# Altium schematic sheet node.SchDoc
size A4
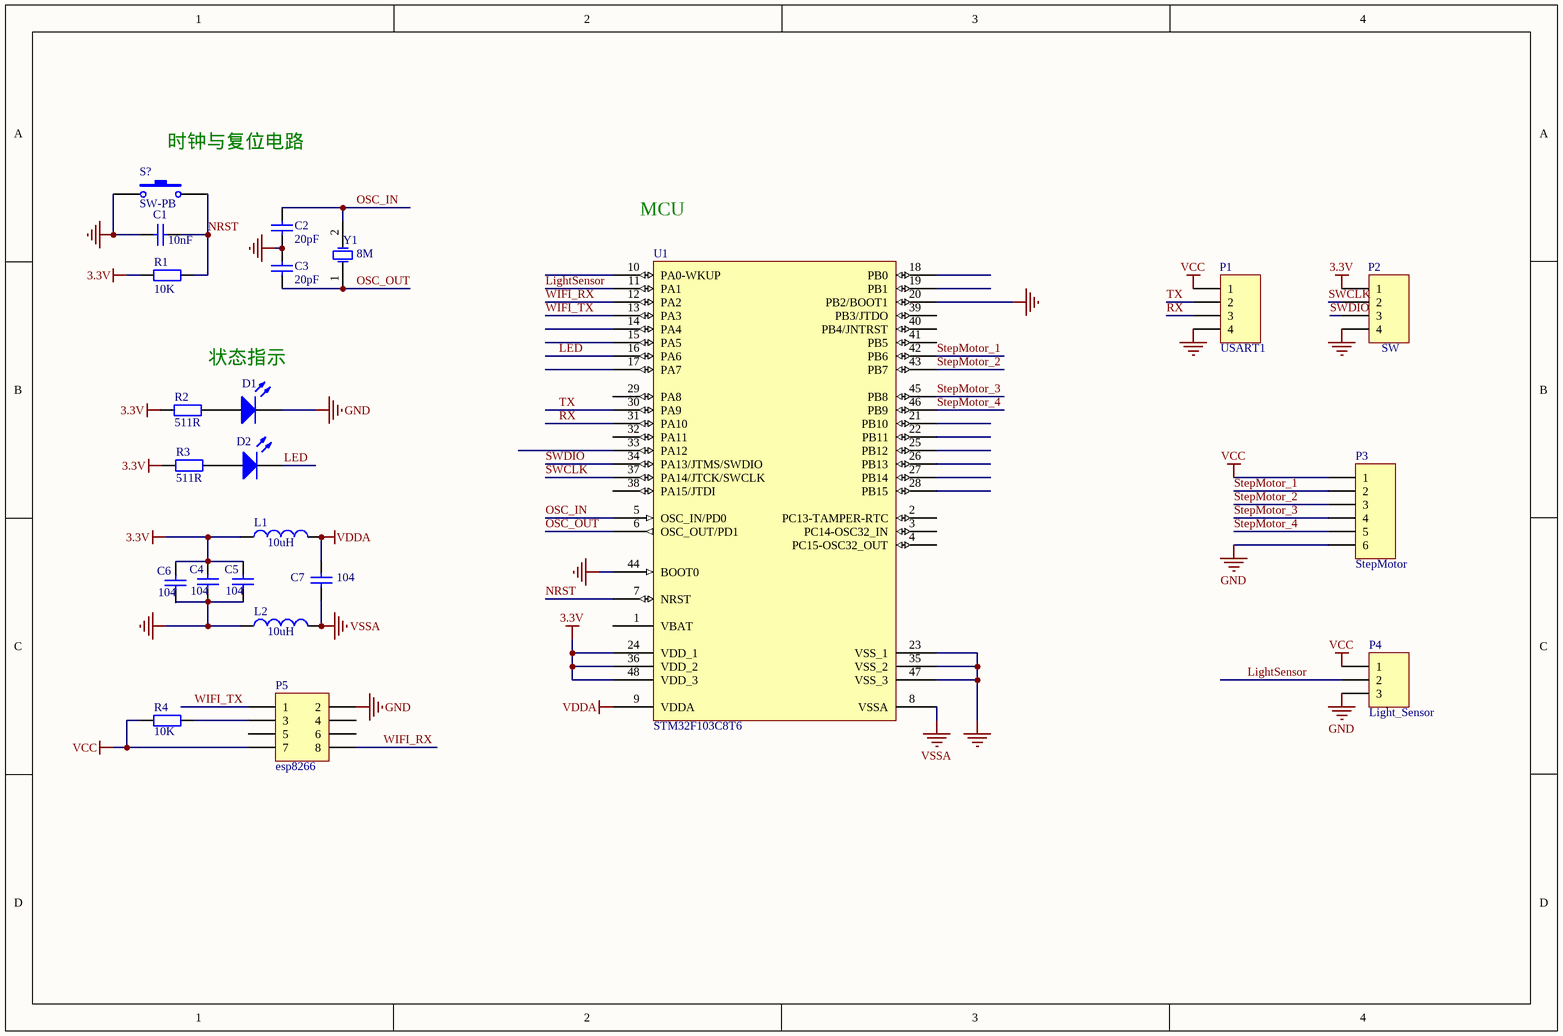
[diagram p0: node.SchDoc]

## Parts
C1  value 10nF  [0603-N-CAP]  (hidden comment: Cap)
C2  value 20pF  [0603-N-CAP]  (hidden comment: Cap)
C3  value 20pF  [0603-N-CAP]  (hidden comment: Cap)
C4  value 104  [0603-N-CAP]  (hidden comment: Cap)
C5  value 104  [0603-N-CAP]  (hidden comment: Cap)
C6  value 104  [0603-N-CAP]  (hidden comment: Cap)
C7  value 104  [0603-N-CAP]  (hidden comment: Cap)
D1  D2  [0603-N - LED-GRREN]  (value not drawn)
D2  D2  [0603-N - LED-RED]  (value not drawn)
L1  value 10uH  [0603-N - res]  (hidden comment: Inductor)
L2  value 10uH  [0603-N - res]  (hidden comment: Inductor)
P1  USART1  [ZH1.5MM_4P]
P2  SW  [ZH1.5MM_4P]
P3  StepMotor  [HDR1X6]
P4  Light_Sensor  [HDR1X3]
P5  esp8266  [HDR2X4]
R1  value 10K  [0603-N - res]  (hidden comment: Res2)
R2  value 511R  [0603-N - res]  (hidden comment: Res2)
R3  value 511R  [0603-N - res]  (hidden comment: Res2)
R4  value 10K  [0603-N - res]  (hidden comment: Res2)
S?  SW-PB  [SPST-2]
U1  STM32F103C8T6  [LQFP48_N]
Y1  8M  [5032_]

## Nets
3.3V: C4.2 C5.2 C6.2 L1.1 P2.1 R1.1 R2.1 R3.1 U1.24(VDD_1) U1.36(VDD_2) U1.48(VDD_3)
GND: C1.1 C2.1 C3.2 C4.1 C5.1 C6.1 D1.2(K) L2.1 P1.4 P2.4 P3.6 P4.3 P5.2 S?.1 U1.20(PB2/BOOT1) U1.23(VSS_1) U1.35(VSS_2) U1.44(BOOT0) U1.47(VSS_3)
VCC: P1.1 P3.1 P4.1 P5.7 R4.2
VDDA: C7.2 L1.2 U1.9(VDDA)
VSSA: C7.1 L2.2 U1.8(VSSA)
LED: D2.2(K) U1.16(PA6)
LightSensor: P4.2 U1.11(PA1)
NRST: C1.2 R1.2 S?.2 U1.7(NRST)
OSC_IN: C2.2 U1.5(OSC_IN/PD0) Y1.2(OSC2)
OSC_OUT: C3.1 U1.6(OSC_OUT/PD1) Y1.1(OSC1)
RX: P1.3 U1.31(PA10)
StepMotor_1: P3.2 U1.42(PB6)
StepMotor_2: P3.3 U1.43(PB7)
StepMotor_3: P3.4 U1.45(PB8)
StepMotor_4: P3.5 U1.46(PB9)
SWCLK: P2.2 U1.37(PA14/JTCK/SWCLK)
SWDIO: P2.3 U1.34(PA13/JTMS/SWDIO)
TX: P1.2 U1.30(PA9)
WIFI_RX: P5.8 U1.12(PA2)
WIFI_TX: P5.1 U1.13(PA3)
NetD1_1: D1.1(A) R2.2
NetD2_1: D2.1(A) R3.2
NetP5_3: P5.3 R4.1

Not connected (* = marked no-connect by the designer): P5 4 5 6; U1 1(VBAT) 2(PC13-TAMPER-RTC) 3(PC14-OSC32_IN) 4(PC15-OSC32_OUT) 10(PA0-WKUP) 14(PA4) 15(PA5) 17(PA7) 18(PB0) 19(PB1) 21(PB10) 22(PB11) 25(PB12) 26(PB13) 27(PB14) 28(PB15) 29(PA8) 32(PA11) 33(PA12) 38(PA15/JTDI) 39(PB3/JTDO) 40(PB4/JNTRST) 41(PB5)

## Notes on the sheet
- (near S?) 时钟与复位电路
- MCU
- 状态指示

## Library data of the parts
C1-C7 = Cap: Capacitor; Published: 8-Jun-2000; LatestRevisionDate: 17-Jul-2002; LatestRevisionNote: Re-released for DXP Platform.; PackageReference: RAD-0.3; Publisher: Altium Limited
D1 D2 = LED3: Typical BLUE SiC LED; Published: 8-Jun-2000; LatestRevisionDate: 17-Dec-2003; LatestRevisionNote: PCB Footprint replaced.; DatasheetDocument: 16-Apr-2002; PackageDocument: 16-Apr-2002; PackageReference: 3.5X2.8X1.9; Publisher: Altium Limited
L1 L2 = Inductor: Code_IEC: 1005; Published: 8-Jun-2000; LatestRevisionDate: 17-Jul-2002; LatestRevisionNote: Re-released for DXP Platform.; PackageReference: 0402-A; Publisher: Altium Limited; Code_JEITA: 0402
P1 P2 = Header 4H: Header, 4-Pin, Right Angle; LatestRevisionDate: 17-Jul-2002; LatestRevisionNote: Re-released for DXP Platform.; Publisher: Altium Limited
P3 = Header 6: Header, 6-Pin; LatestRevisionDate: 17-Jul-2002; LatestRevisionNote: Re-released for DXP Platform.; Publisher: Altium Limited
P4 = Header 3: Header, 3-Pin; LatestRevisionDate: 17-Jul-2002; LatestRevisionNote: Re-released for DXP Platform.; Publisher: Altium Limited
P5 = Header 4X2: Header, 4-Pin, Dual row; LatestRevisionDate: 17-Jul-2002; LatestRevisionNote: Re-released for DXP Platform.; Publisher: Altium Limited
R1-R4 = Res2: Resistor; Published: 8-Jun-2000; LatestRevisionDate: 17-Jul-2002; LatestRevisionNote: Re-released for DXP Platform.; PackageReference: AXIAL-0.4; Publisher: Altium Limited
  R4: PackageDescription: Axial Device, Thru-Hole; 2 Leads; 0.4 in Pin Spacing
S? = SW-PB: Switch; Published: 24-Mar-1999; LatestRevisionDate: 17-Jul-2002; LatestRevisionNote: Re-released for DXP Platform.; PackageReference: SPST-2; Publisher: Altium Limited; PackageDescription: Switch; 2 Leads
U1 = STM32F103C8T6: STM32 ARM-based 32-bit MCU with 64 Kbytes Flash, 48-pin LQFP, Industrial Temperature; Published: 30-May-2008; DatasheetVersion: rev6, Mar-2008; PackageVersion: Mar-2008; PackageReference: LQFP48; Publisher: Altium Limited; PackageDescription: 48-Pin Low-Profile Quad Flat Pack, 7 x 7 mm Body, 0.5 mm Pitch (LQFP48); ComponentLink1Description: Manufacturer Link; ComponentLink1URL: www.st.com/stm32; ComponentLink2Description: Datasheet; ComponentLink2URL: http://www.st.com/stonline/products/literature/ds/13587.pdf
Y1 = XTAL: Crystal Oscillator; pin to pad: 2>3; Published: 8-Jun-2000; LatestRevisionDate: 17-Jul-2002; LatestRevisionNote: Re-released for DXP Platform.; PackageReference: R38; Publisher: Altium Limited